# EasyEDA schematic schematic.json
TITLE: Sheet_1; REV: 1.0; Date: 2024-06-04; Sheet: 1/1; Drawn By: jennifer_zz; Company: Your Company
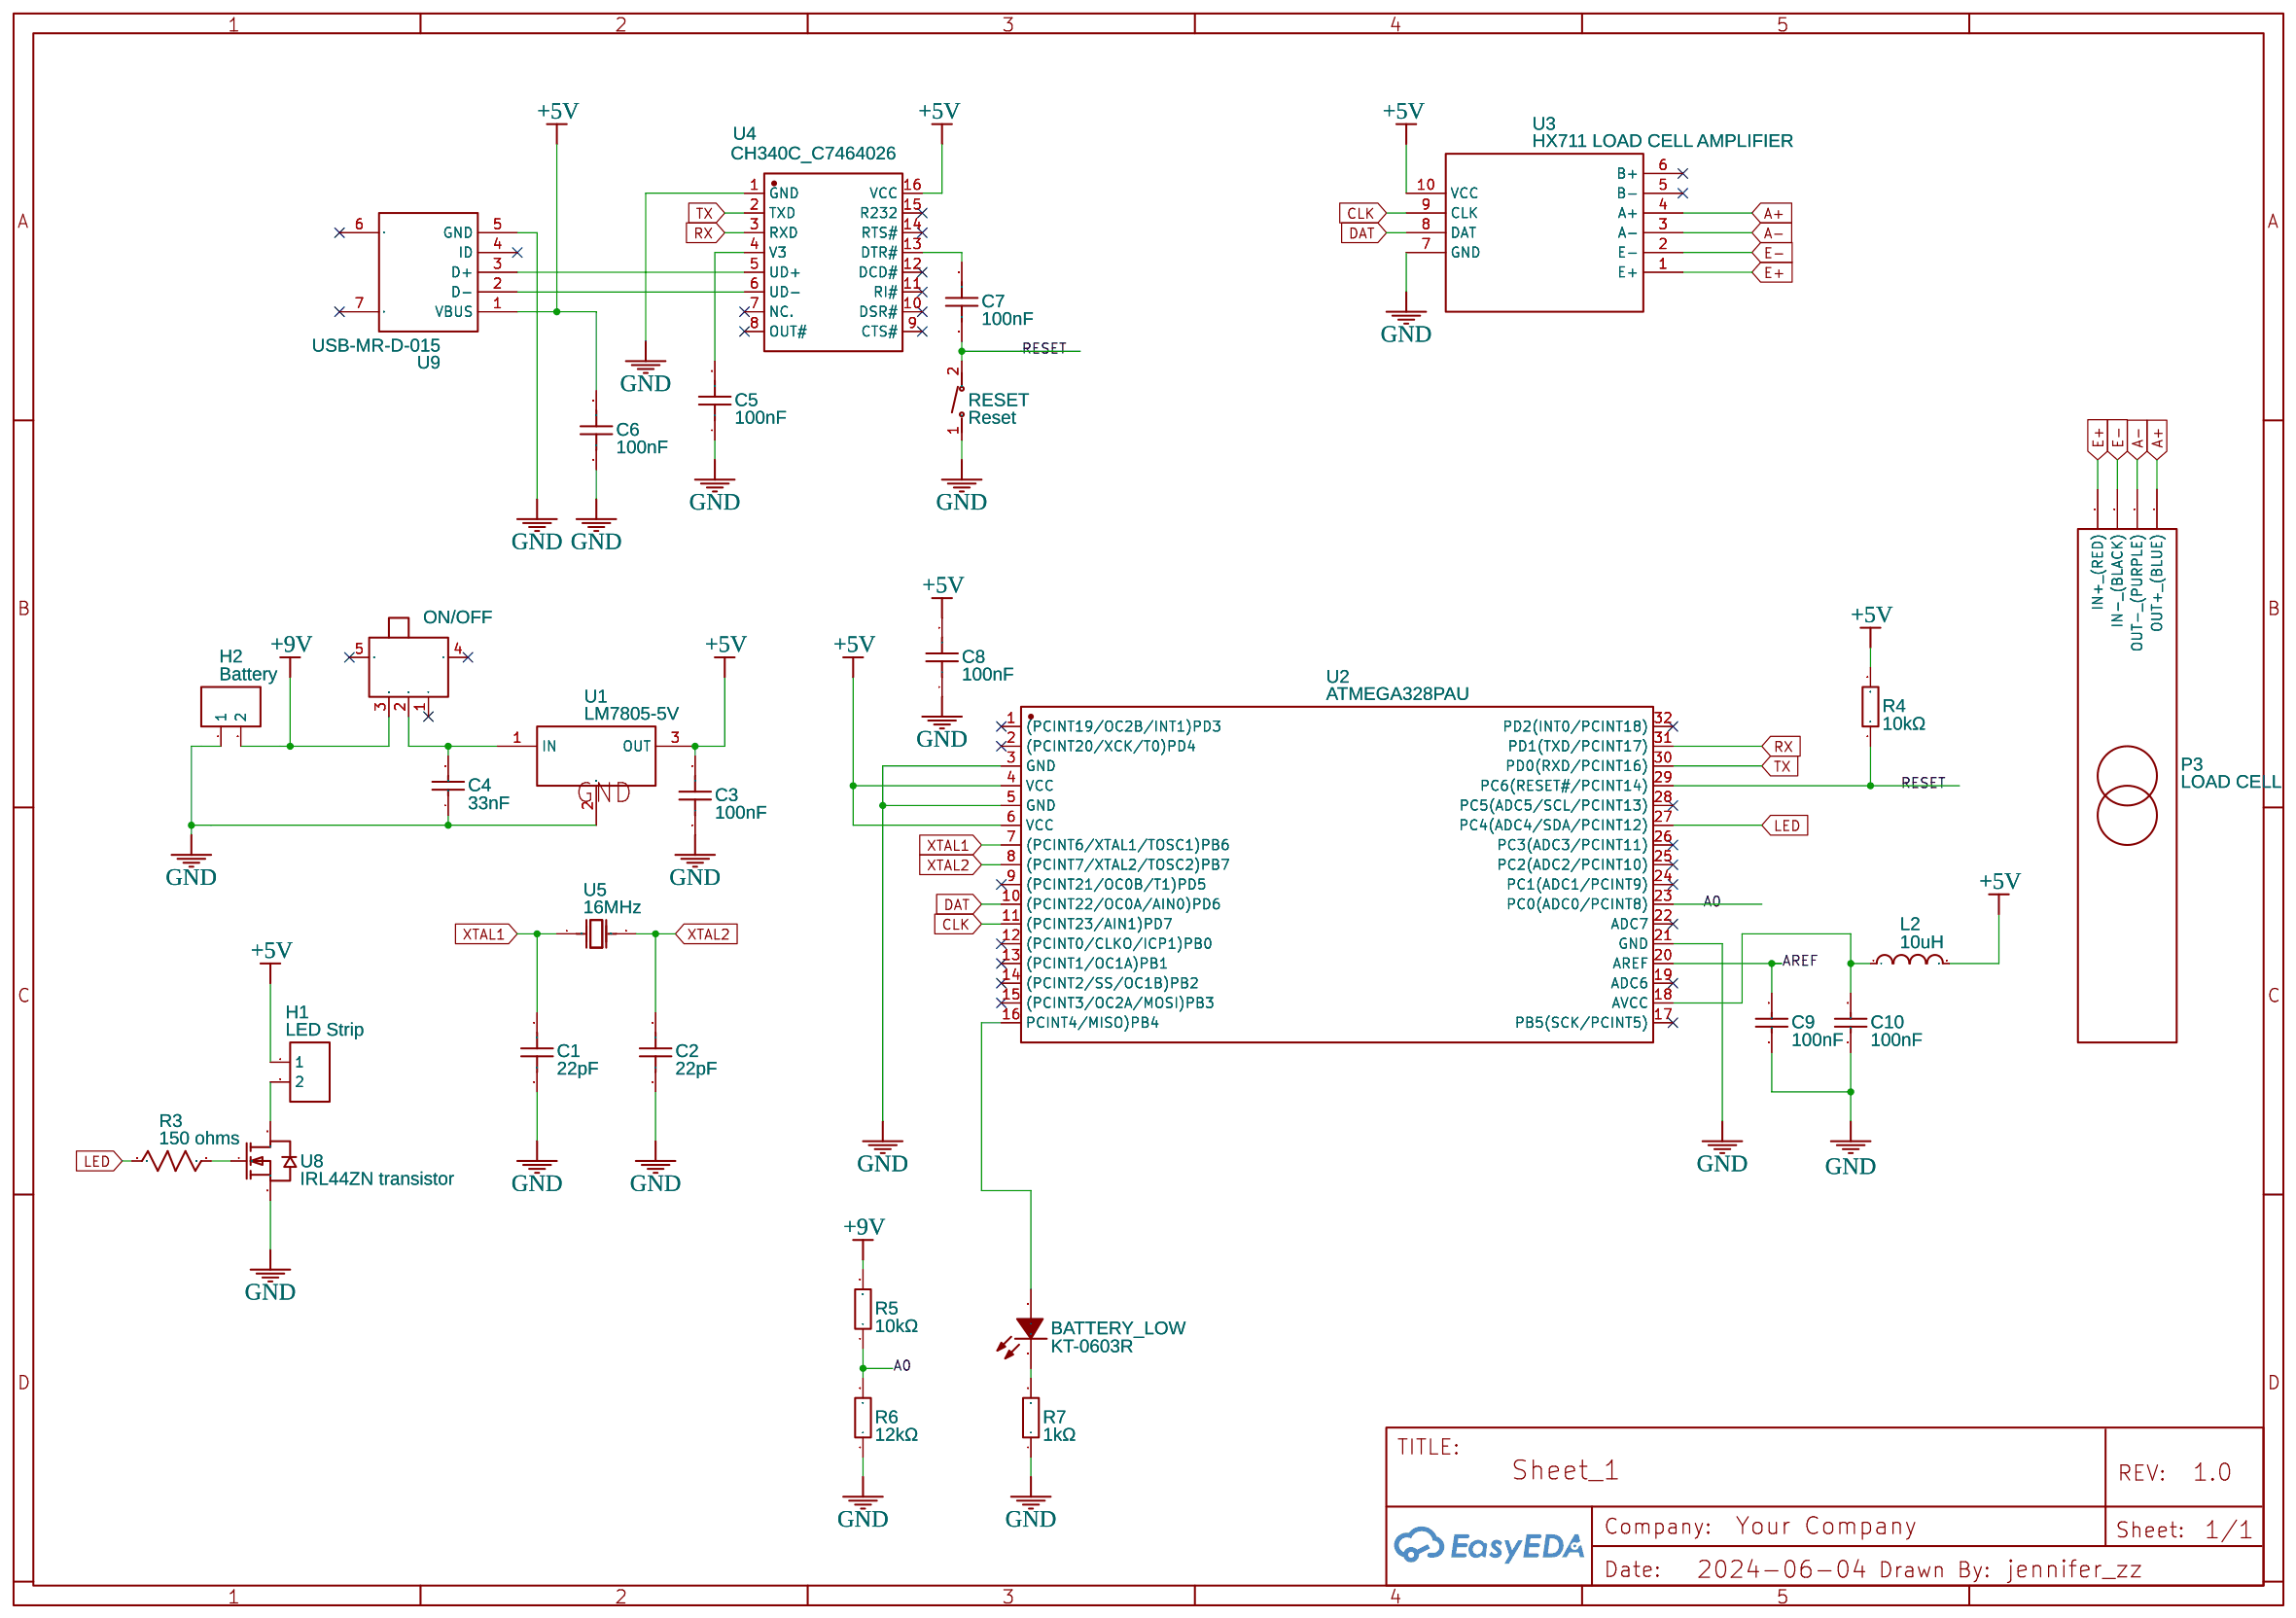
[diagram p0: schematic sheet]

## Parts
BATTERY_LOW  KT-0603R  [LED0603-RD]
C1  22pF  [C0603]
C2  22pF  [C0603]
C3  100nF  [C0603]
C4  33nF  [C0603]
C5  100nF  [C0603]
C6  100nF  [C0603]
C7  100nF  [C0603]
C8  100nF  [C0603]
C9  100nF  [C0603]
C10  100nF  [C0603]
H1  LED Strip  [HDR-F-2.54_1X2]
H2  Battery  [HDR-F-2.54_1X2]
L2  10uH  [L0805]
ON/OFF  switch  [SW-TH_SS12D07VG4]
P3  LOAD CELL  [LOADCELL_CONN]
R3  150 ohms  [R0603]
R4  10kΩ  [R0603]
R5  10kΩ  [R0603]
R6  12kΩ  [R0603]
R7  1kΩ  [R0603]
RESET  Reset  [KEY-SMD_L6.0-W6.0-LS6.6]
U1  LM7805-5V  [TO-252-2_L6.6-W6.1-P4.58-LS9.9-TL]
U2  ATMEGA328PAU  [LQFP-32_L7.0-W7.0-P0.80-LS9.0-BL]
U3  HX711 LOAD CELL AMPLIFIER  [HX711 LOAD CELL AMPLIFIER HX711 BREAKOUT]
U4  CH340C_C7464026  [SOP-16_L10.0-W3.9-P1.27-LS6.0-BL]
U5  16MHz  [CRYSTAL-SMD_L7.0-W4.0-LS7.8]
U8  IRL44ZN transistor  [SOT-23-3_L2.9-W1.3-P1.90-LS2.4-BR]
U9  USB-MR-D-015  [MICRO-USB-SMD_920-C52A2021S10105]

## Library data of the parts
BATTERY_LOW = KT-0603R: Supplier: LCSC; Manufacturer: KENTO; Supplier Part: C2286; JLCPCB Part Class: Basic Part
C1 C2 = C_0603_US: Contributor: LCEDA_Lib
C3 C5-C8 = CC0603KRX7R9BB104: Supplier: LCSC; Manufacturer: YAGEO(国巨); Supplier Part: C14663; JLCPCB Part Class: Basic Part
C4 = CL10B333KB8NNNC: Supplier: LCSC; Manufacturer: SAMSUNG(三星); Supplier Part: C21117; JLCPCB Part Class: Basic Part
C9 C10 = CL10B104KO8NNNC: Supplier: LCSC; Manufacturer: SAMSUNG(三星); Supplier Part: C66501; JLCPCB Part Class: Extended Part
H1 H2 = HDR-F-2.54_1x2: Supplier Part: C49661; Supplier: LCSC; Contributor: LCEDA_Lib
L2 = CV201210-100K: Supplier: LCSC; Supplier Part: C1329468; Manufacturer: BOURNS; link: https://atta.szlcsc.com/upload/public/pdf/source/20210429/3B86783B0093E2E171EE940FFC38C3A3.pdf; JLCPCB Part Class: Extended Part; Contributor: lcsc
ON/OFF = SS12D07VG4 087: Contributor: LCSC; Supplier: LCSC; Supplier Part: C2939726; Manufacturer: SHOU HAN(首韩); JLCPCB Part Class: Extended Part
P3 = LOAD CELL: Supplier: Amazon; Contributor: geloh1240
R3 = R_0603_US: Contributor: LCEDA_Lib
R4 R5 = 0603WAF1002T5E: Supplier: LCSC; Manufacturer: UNI-ROYAL(厚声); Supplier Part: C25804; JLCPCB Part Class: Basic Part
R6 = QR0603F12KP05: Contributor: LCSC; Supplier: LCSC; Supplier Part: C176142; Manufacturer: EVER OHMS(天二科技); Manufacturer Part: QR0603F12K0P05Z; JLCPCB Part Class: Extended Part
R7 = 0603WAF1001T5E: Supplier: LCSC; Manufacturer: UNI-ROYAL(厚声); Supplier Part: C21190; JLCPCB Part Class: Basic Part
RESET = BUTTON_C9900040040: Contributor: lcsc; Supplier: LCSC; Supplier Part: C9900040040; Manufacturer: null; Manufacturer Part: BUTTON; JLCPCB Part Class: Extended Part
U1 = LM7805-5V: Contributor: LCSC; Supplier: LCSC; Supplier Part: C9900008050; Manufacturer: null; JLCPCB Part Class: Extended Part
U2 = ATMEGA328PAU: Contributor: lcsc; Supplier: LCSC; Supplier Part: C9900004716; Manufacturer: null; Manufacturer Part: Atmega328pAU; JLCPCB Part Class: Extended Part
U3 = HX711 LOAD CELL AMPLIFIER: Contributor: binulidulsarani1234
U4 = CH340C_C7464026: Contributor: lcsc; Supplier: LCSC; Supplier Part: C7464026; Manufacturer: WCH(南京沁恒); Manufacturer Part: CH340C; JLCPCB Part Class: Extended Part
U5 = D22011000143-Y1: Contributor: LCSC; Supplier: LCSC; Supplier Part: C9900005978; Manufacturer: null; JLCPCB Part Class: Extended Part
U8 = SI2302-NMOSFET: Contributor: LCSC; Supplier: LCSC; Supplier Part: C9900002167; Manufacturer: null; Manufacturer Part: si2302-nmosfet; JLCPCB Part Class: Extended Part
U9 = USB-MR-D-015: Contributor: lcsc; Supplier: LCSC; Supplier Part: C2926986; Manufacturer: DEALON(德艺隆)

## Nets
+5V: C3.2 C6.2 C8.2 H1.1 L2.2 R4.2 U1.3(OUT) U2.4(VCC) U2.6(VCC) U3.10(VCC) U4.16(VCC) U9.1(VBUS)
+9V: H2.2 ON/OFF.3 R5.2
GND: C1.2 C2.2 C3.1 C4.1 C5.1 C6.1 C8.1 C9.1 C10.1 H2.1 R6.1 R7.1 RESET.1(A) U1.2(GND) U2.3(GND) U2.5(GND) U2.21(GND) U3.7(GND) U4.1(GND) U8.2(S) U9.5(GND)
A0: R5.1 R6.2 U2.23(PC0(ADC0/PCINT8))
A+: P3.4(OUT+ (BLUE)) U3.4(A+)
A-: P3.3(OUT- (PURPLE)) U3.3(A-)
AREF: C9.2 U2.20(AREF)
CLK: U2.11((PCINT23/AIN1)PD7) U3.9(CLK)
DAT: U2.10((PCINT22/OC0A/AIN0)PD6) U3.8(DAT)
E+: P3.1(IN+ (RED)) U3.1(E+)
E-: P3.2(IN- (BLACK)) U3.2(E-)
LED: R3.1 U2.27(PC4(ADC4/SDA/PCINT12))
RESET: C7.1 R4.1 RESET.2(B) U2.29(PC6(RESET#/PCINT14))
RX: U2.31(PD1(TXD/PCINT17)) U4.3(RXD)
TX: U2.30(PD0(RXD/PCINT16)) U4.2(TXD)
XTAL1: C1.1 U2.7((PCINT6/XTAL1/TOSC1)PB6) U5.1(OSC1)
XTAL2: C2.1 U2.8((PCINT7/XTAL2/TOSC2)PB7) U5.2(OSC2)
Net-(BATTERY_LOW-1): BATTERY_LOW.1(K) R7.2
Net-(BATTERY_LOW-2): BATTERY_LOW.2(A) U2.16(PCINT4/MISO)PB4)
Net-(C4-2): C4.2 ON/OFF.2 U1.1(IN)
Net-(C5-2): C5.2 U4.4(V3)
Net-(C7-2): C7.2 U4.13(DTR#)
Net-(C10-2): C10.2 L2.1 U2.18(AVCC)
Net-(H1-2): H1.2 U8.3(D)
Net-(R3-2): R3.2 U8.1(G)
Net-(U4-5): U4.5(UD+) U9.3(D+)
Net-(U4-6): U4.6(UD-) U9.2(D-)

Not connected (* = marked no-connect by the designer): ON/OFF 1* 4* 5*; U2 1((PCINT19/OC2B/INT1)PD3)* 2((PCINT20/XCK/T0)PD4)* 9((PCINT21/OC0B/T1)PD5)* 12((PCINT0/CLKO/ICP1)PB0)* 13((PCINT1/OC1A)PB1)* 14((PCINT2/SS/OC1B)PB2)* 15((PCINT3/OC2A/MOSI)PB3)* 17(PB5(SCK/PCINT5))* 19(ADC6)* 22(ADC7)* 24(PC1(ADC1/PCINT9))* 25(PC2(ADC2/PCINT10))* 26(PC3(ADC3/PCINT11))* 28(PC5(ADC5/SCL/PCINT13))* 32(PD2(INT0/PCINT18))*; U3 5(B-)* 6(B+)*; U4 7(NC.)* 8(OUT#)* 9(CTS#)* 10(DSR#)* 11(RI#)* 12(DCD#)* 14(RTS#)* 15(R232)*; U9 4(ID)* 6(EH)* 7(EH)*
